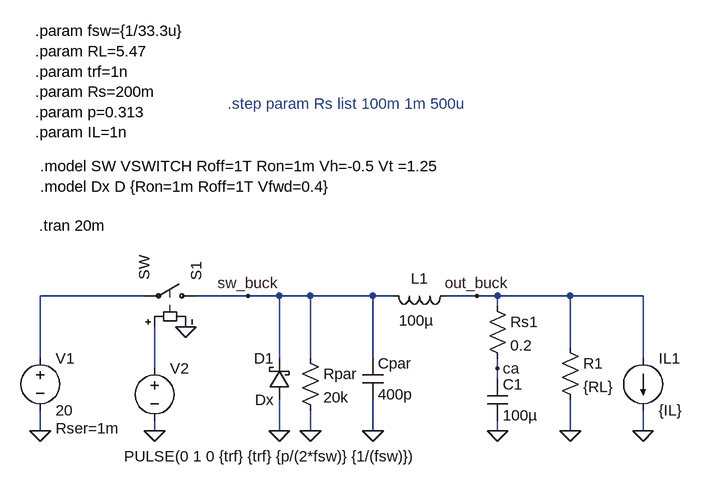
[diagram p0: schematic buck_labor.asc]
buck_labor.asc, the LTspice schematic file:
Version 4
SHEET 1 880 680
WIRE -2016 -80 -2176 -80
WIRE -1856 -80 -1936 -80
WIRE -1808 -80 -1856 -80
WIRE -1760 -80 -1808 -80
WIRE -1664 -80 -1760 -80
WIRE -1632 -80 -1664 -80
WIRE -1504 -80 -1552 -80
WIRE -1472 -80 -1504 -80
WIRE -1360 -80 -1472 -80
WIRE -1248 -80 -1360 -80
WIRE -1472 -64 -1472 -80
WIRE -1360 0 -1360 -80
WIRE -2176 16 -2176 -80
WIRE -1808 16 -1808 -80
WIRE -1760 16 -1760 -80
WIRE -1664 16 -1664 -80
WIRE -1248 16 -1248 -80
WIRE -2000 32 -2000 -32
WIRE -1472 32 -1472 16
WIRE -1472 48 -1472 32
WIRE -2176 128 -2176 96
WIRE -2000 128 -2000 112
WIRE -1808 128 -1808 80
WIRE -1760 128 -1760 96
WIRE -1664 128 -1664 80
WIRE -1472 128 -1472 112
WIRE -1360 128 -1360 80
WIRE -1248 128 -1248 96
FLAG -1808 128 0
FLAG -2176 128 0
FLAG -1952 -32 0
FLAG -2000 128 0
FLAG -1856 -80 sw_buck
FLAG -1504 -80 out_buck
FLAG -1248 128 0
FLAG -1472 128 0
FLAG -1472 32 ca
FLAG -1760 128 0
FLAG -1664 128 0
FLAG -1360 128 0
SYMBOL sw -1920 -80 M270
SYMATTR InstName S1
SYMBOL voltage -2176 0 R0
WINDOW 123 0 0 Left 2
WINDOW 39 24 124 Left 2
SYMATTR InstName V1
SYMATTR Value 20
SYMATTR SpiceLine Rser=1m
SYMBOL ind -1536 -96 R90
WINDOW 0 5 56 VBottom 2
WINDOW 3 38 61 VTop 2
SYMATTR InstName L1
SYMATTR Value 100µ
SYMBOL schottky -1792 80 R180
WINDOW 0 24 64 Left 2
WINDOW 3 24 0 Left 2
SYMATTR InstName D1
SYMATTR Value Dx
SYMATTR Description Diode
SYMATTR Type diode
SYMBOL cap -1488 48 R0
SYMATTR InstName C1
SYMATTR Value 100µ
SYMBOL voltage -2000 16 R0
WINDOW 3 -47 151 Left 2
WINDOW 123 0 0 Left 2
WINDOW 39 0 0 Left 2
SYMATTR InstName V2
SYMATTR Value PULSE(0 1 0 {trf} {trf} {p/(2*fsw)} {1/(fsw)})
SYMBOL current -1248 16 R0
WINDOW 123 0 0 Left 2
WINDOW 39 0 0 Left 2
SYMATTR InstName IL1
SYMATTR Value {IL}
SYMBOL res -1488 -80 R0
SYMATTR InstName Rs1
SYMATTR Value 0.2
SYMBOL res -1776 0 R0
SYMATTR InstName Rpar
SYMATTR Value 20k
SYMBOL cap -1680 16 R0
SYMATTR InstName Cpar
SYMATTR Value 400p
SYMBOL res -1376 -16 R0
SYMATTR InstName R1
SYMATTR Value {RL}
TEXT -2176 -280 Left 2 !.model SW VSWITCH Roff=1T Ron=1m Vh=-0.5 Vt =1.25
TEXT -2184 -488 Left 2 !.param fsw={1/33.3u}\n.param RL=5.47\n.param trf=1n\n.param Rs=200m\n.param p=0.313\n.param IL=1n
TEXT -2178 -188 Left 2 !.tran 20m
TEXT -1888 -376 Left 2 ;.step param Rs list 100m 1m 500u
TEXT -2176 -248 Left 2 !.model Dx D {Ron=1m Roff=1T Vfwd=0.4}

The netlist it stands for:
* buck_labor.asc
S1 sw_buck N001 N002 0 SW
V1 N001 0 20 Rser=1m
L1 out_buck sw_buck 100µ
D1 0 sw_buck Dx
C1 ca 0 100µ
V2 N002 0 PULSE(0 1 0 {trf} {trf} {p/(2*fsw)} {1/(fsw)})
IL1 out_buck 0 {IL}
Rs1 out_buck ca 0.2
Rpar sw_buck 0 20k
Cpar sw_buck 0 400p
R1 out_buck 0 {RL}
.model D D
.lib standard.dio
.model SW VSWITCH Roff=1T Ron=1m Vh=-0.5 Vt =1.25
.param fsw={1/33.3u}
.param RL=5.47
.param trf=1n
.param Rs=200m
.param p=0.313
.param IL=1n
.tran 20m
* .step param Rs list 100m 1m 500u
.model Dx D {Ron=1m Roff=1T Vfwd=0.4}
.backanno
.end